# Altium schematic sheet RTC.SchDoc: Titel
size A3; ApprovedBy: name; CompanyName: DCI Electronics bv; DrawnBy: KRS; Address1: Nijverheidsstraat 14; Address2: 4458 AV Eindewege; Address3: Phone: +31 (0)113 344880; DocumentNumber: 10; Revision: 2; SheetNumber: 10; SheetTotal: 14; PageSetup: Record=PageOptions|CenterHorizontal=True|CenterVertical=True|PrintScale=1.00|XCorrection=1.00|YCorrection=1.00|PrintKind=1|BorderSize=5000000|LeftOffset=0|BottomOffset=0|Orientation=2|PaperLength=1000|PaperWidth=1000|Scale=100|PaperSource=7|PrintQuality=-4|MediaType=1|DitherType=10|PaperKind=ISO_A4_(210.00_x_297.00_MM)|PrintScaleMode=1; SubTitle: SubTitel; ApprovedDate: 01-01-12
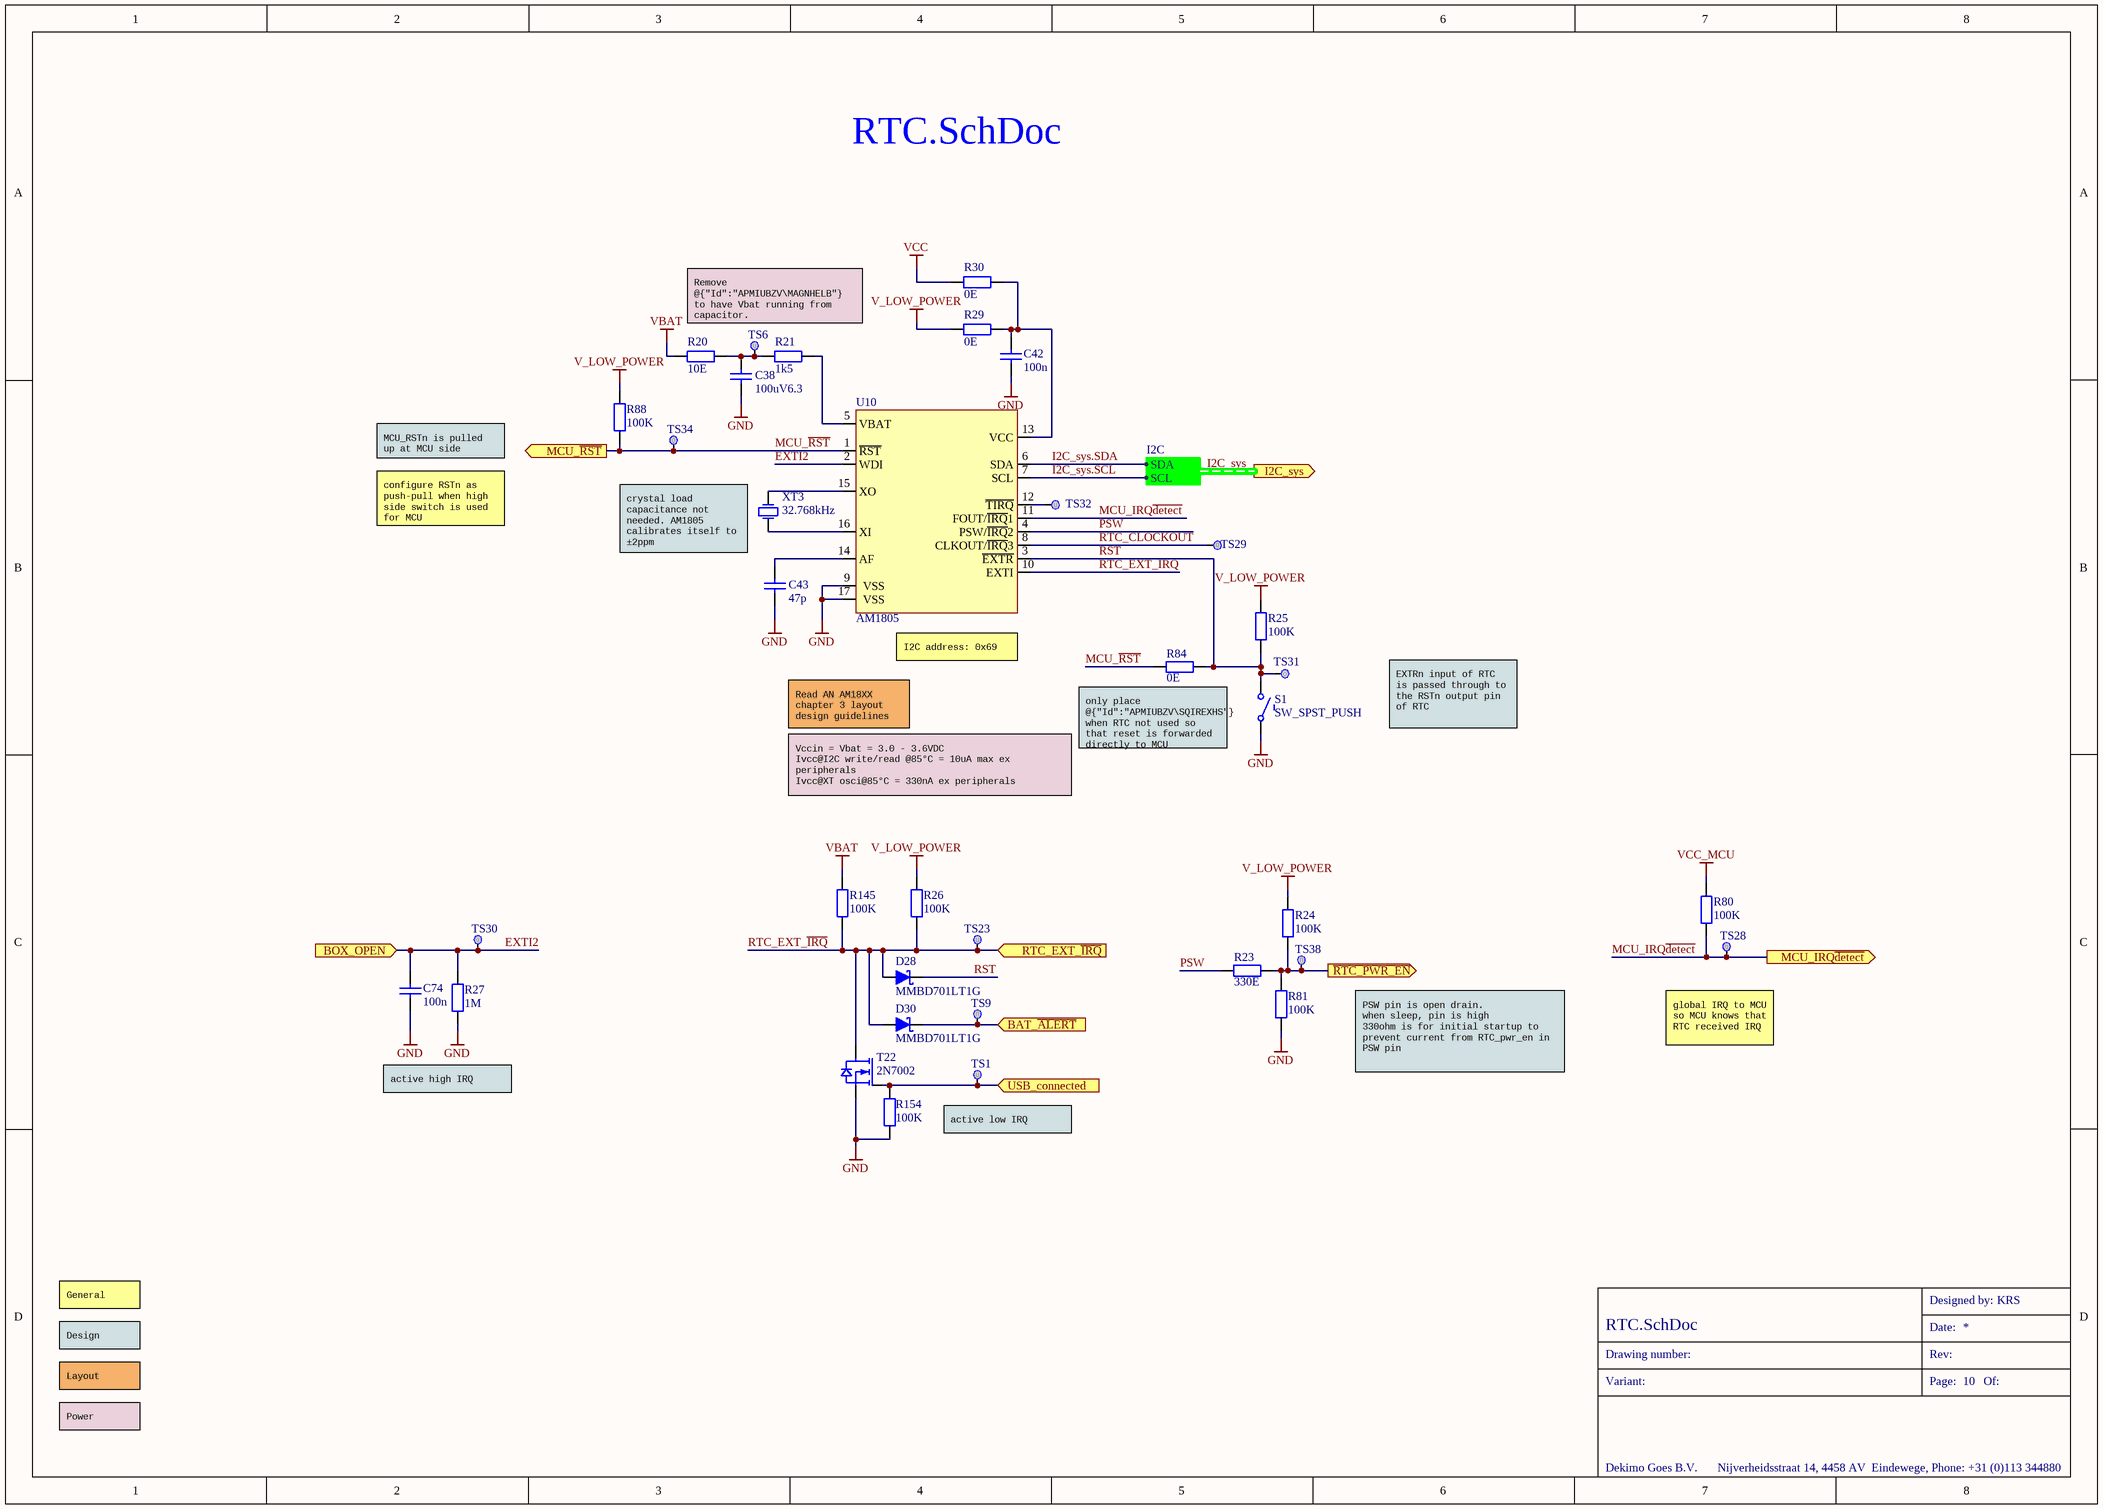
[diagram p0: RTC.SchDoc]

## Parts
C38  100uV6.3  [CAPC3216X13N]
C42  100n  [CAPC1608X09N]
C43  47p  [CAPC1608X09N]
C74  100n  [CAPC1608X09N]
D28  MMBD701LT1G  [SOT95P245X110-3N]
D30  MMBD701LT1G  [SOT95P245X110-3N]
R20  10E  [RESC1608X13N]
R21  1k5  [RESC1608X13N]
R23  330E  [RESC1608X13N]
R24  100K  [RESC1608X13N]
R25  100K  [RESC1608X13N]
R26  100K  [RESC1608X13N]
R27  1M  [RESC1608X13N]
R29  0E  [RESC1005X04N]
R30  0E  [RESC1005X04N]
R80  100K  [RESC1608X13N]
R81  100K  [RESC1608X13N]
R84  0E  [RESC1608X13N]
R88  100K  [RESC1608X13N]
R145  100K  [RESC1608X13N]
R154  100K  [RESC1608X13N]
S1  SW_SPST_PUSH  [B3S-1000P]
T22  2N7002  [SOT95P245X110_GSD-3N]
TS1  TESTPAD  [TESTPAD 2MM]  (value not drawn)  (no BOM)
TS6  TESTPAD  [TESTPAD 2MM]  (value not drawn)  (no BOM)
TS9  TESTPAD  [TESTPAD 2MM]  (value not drawn)  (no BOM)
TS23  TESTPAD  [TESTPAD 2MM]  (value not drawn)  (no BOM)
TS28  TESTPAD  [TESTPAD 2MM]  (value not drawn)  (no BOM)
TS29  TESTPAD  [TESTPAD 2MM]  (value not drawn)  (no BOM)
TS30  TESTPAD  [TESTPAD 2MM]  (value not drawn)  (no BOM)
TS31  TESTPAD  [TESTPAD 2MM]  (value not drawn)  (no BOM)
TS32  TESTPAD  [TESTPAD 2MM]  (value not drawn)  (no BOM)
TS34  TESTPAD  [TESTPAD 2MM]  (value not drawn)  (no BOM)
TS38  TESTPAD  [TESTPAD 2MM]  (value not drawn)  (no BOM)
U10  AM1805  [QFN-500G000-016]
XT3  32.768kHz  [CHIP2PINSM127P600-8N]

## Ports
BAT_~{ALERT} (in), BOX_OPEN (in), I2C_sys (out, harness I2C), MCU_IRQ~{detect} (out), MCU_~{RST} (out), RTC_EXT_~{IRQ} (in), USB_connected (in), ~{RTC_PWR_EN} (out)

## Harnesses
I2C: SDA, SCL

## Nets
GND: C38.1 C42.1 C43.1 C74.1 R27.1 R81.1 R154.1 S1.COM1(COMMON) T22.S U10.9(VSS) U10.17(VSS)
V_LOW_POWER: R24.2 R25.2 R26.2 R29.1 R88.2
VBAT: R20.1 R145.2
VCC: R30.1
VCC_MCU: R80.2
\: D28.C R25.1 R84.2 S1.NO1(NO) TS31.1(TP) U10.3(~{EXTR})  [also labelled RST]
~{RTC_PWR_EN}: R23.2 R24.1 R81.2 TS38.1(TP) ; port ~{RTC_PWR_EN}
BAT_~{ALERT}: D30.C TS9.1(TP) ; port BAT_~{ALERT}
EXTI2: C74.2 R27.2 TS30.1(TP) U10.2(WDI) ; port BOX_OPEN
I2C_sys.SCL: U10.7(SCL) ; port I2C_sys.SCL
I2C_sys.SDA: U10.6(SDA) ; port I2C_sys.SDA
MCU_IRQ~{detect}: R80.1 TS28.1(TP) U10.11(FOUT/~{IRQ}1) ; port MCU_IRQ~{detect}
MCU_~{RST}: R84.1 R88.1 TS34.1(TP) U10.1(~{RST}) ; port MCU_~{RST}
PSW: R23.1 U10.4(PSW/~{IRQ}2)
RTC_CLOCKOUT: TS29.1(TP) U10.8(CLKOUT/~{IRQ}3)
RTC_EXT_~{IRQ}: D28.A D30.A R26.1 R145.1 T22.D TS23.1(TP) U10.10(EXTI) ; port RTC_EXT_~{IRQ}
USB_connected: R154.2 T22.G TS1.1(TP) ; port USB_connected
NetC38_2: C38.2 R20.2 R21.1 TS6.1(TP)
NetC42_2: C42.2 R29.2 R30.2 U10.13(VCC)
NetC43_2: C43.2 U10.14(AF)
NetR21_2: R21.2 U10.5(VBAT)
NetTS32_1: TS32.1(TP) U10.12(~{TIRQ})
NetU10_15: U10.15(XO) XT3.2(OSC2)
NetU10_16: U10.16(XI) XT3.1(OSC1)

## Buses and harness runs
harness I2C_sys = port I2C_sys

## Notes on the sheet
- Remove @{"Id":"APMIUBZV\MAGNHELB"} to have Vbat running from capacitor.
  100uF gives about 1.7h run time in autocal mode
- MCU_RSTn is pulled up at MCU side
- configure RSTn as push-pull when high side switch is used for MCU
- (near XT3) crystal load capacitance not needed. AM1805 calibrates itself to ±2ppm
- Read AN AM18XX chapter 3 layout design guidelines
- (near U10) I2C address: 0x69
- EXTRn input of RTC is passed through to the RSTn output pin of RTC
- only place @{"Id":"APMIUBZV\SQIREXHS"} when RTC not used so that reset is forwarded directly to MCU
- Vccin = Vbat = 3.0 - 3.6VDC
  Ivcc@I2C write/read @85°C = 10uA max ex peripherals
  Ivcc@XT osci@85°C = 330nA ex peripherals
- (near TS28) global IRQ to MCU so MCU knows that RTC received IRQ
- active high IRQ
- (near TS1) active low IRQ
- PSW pin is open drain.
  when sleep, pin is high
  330ohm is for initial startup to prevent current from RTC_pwr_en in PSW pin
- General
- Design
- Layout
- Power
- Designed by:
- Drawing number:
- Variant:
- Date:
- Page:
- Rev:
- Of:
- Dekimo Goes B.V.
- Nijverheidsstraat 14, 4458 AV  Eindewege, Phone: +31 (0)113 344880

## Library data of the parts
C38 = CKE 100UV6.3/10: 100uF 20% 6.3VX5R; EngPartGrpMainCode: CAP; ManufactpartCode: GRM31CR60J107ME39L-MUR; Type: Capacitor ceramic SMD; Preferred: False; SMD_Flag: True; PartCode: CKE 100UV6.3/10
C42 C74 = CKE 100N/60: 100nF 50V 10% X7R; EngPartGrpMainCode: CAP; ManufactpartCode: CC0603KRX7R9BB104-YAG; Type: Capacitor ceramic SMD; Preferred: False; SMD_Flag: True; PartCode: CKE 100N/60
C43 = CKE 47P/60: 47p 50V 5% NP0; EngPartGrpMainCode: CAP; ManufactpartCode: CC0603JRNPO9BN470-YAG; Type: Capacitor ceramic SMD; Preferred: False; SMD_Flag: True; PartCode: CKE 47P/60
D28 D30 = DIO MMBD701LT1G: 70V Low leakage 200nA; EngPartGrpMainCode: DIO; ManufactpartCode: MMBD701LT1G-ONS; Type: Diode schottky SMD; Preferred: False; SMD_Flag: True; PartCode: DIO MMBD701LT1G
R20 = R 10E/60: 10E 0.1W 1%; EngPartGrpMainCode: RES; ManufactpartCode: RC0603FR-0710RL-YAG; Preferred: False; SMD_Flag: True; PartCode: R 10E/60; Type: Resistor metalfilm SMD
R21 = R 1K5/60: 1K5, 100mW, 1%; EngPartGrpMainCode: RES; ManufactpartCode: RC0603FR-071K5L-YAG; Preferred: False; SMD_Flag: True; PartCode: R 1K5/60; Type: Resistor metalfilm SMD
R23 = R 330E/60: 330E, 100mW, 1%; EngPartGrpMainCode: RES; ManufactpartCode: RC0603FR-07330RL-YAG; Preferred: True; PartCode: R 330E/60; Type: Resistor metalfilm SMD; SMD_Flag: True
R24-R26 R80 R81 R88 R145 R154 = R 100K/60: 100k 100mW, 1%; EngPartGrpMainCode: RES; ManufactpartCode: CRG0603F100K-TEC; Preferred: True; PartCode: R 100K/60; Type: Resistor metalfilm SMD; SMD_Flag: True
R27 = R 1M/60: 1M 0.1W 1%; PartCode: R 1M/60; EngPartGrpMainCode: RES; ManufactpartCode: RC0603FR-071ML-YAG; Preferred: False; SMD_Flag: True; Type: Resistor metalfilm SMD
R29 R30 = R 0E/70: 0E, 62.5mW, 1%; PartCode: R 0E/70; EngPartGrpMainCode: RES; ManufactpartCode: RC0402JR-070RL-YAG; Preferred: False; SMD_Flag: True; Type: Resistor metalfilm SMD
R84 = R 0E/60: 0E 100mW, 1%; PartCode: R 0E/60; EngPartGrpMainCode: RES; ManufactpartCode: RC0603FR-070RL-YAG; Preferred: True; Type: Resistor metalfilm SMD; SMD_Flag: True
S1 = SW PBSPNO/25: PCB SPNO 6x6.6mm, h=4,3mm refl; EngPartGrpMainCode: SWI; ManufactpartCode: B3S-1000P-OMR; Preferred: False; SMD_Flag: True; PartCode: SW PBSPNO/25; Type: Switch push button SMD
T22 = TRA 2N7002: 60V 115mA; EngPartGrpMainCode: TRAN; ManufactpartCode: 2N7002-PHI; Type: FET N-channel SMD; Preferred: False; SMD_Flag: True; PartCode: TRA 2N7002
TS1 TS6 TS9 TS23 TS28-TS32 TS34 TS38 = TESTPAD-2.0: 0.5mm Testpad SMD; PartCode: TESTPAD-2.0
U10 = IC AM1805: Low power I2C RTC; EngPartGrpMainCode: IC; ManufactpartCode: AM1805AQ-AMB; Preferred: False; SMD_Flag: True; PartCode: IC AM1805; Type: IC RTC SMD
XT3 = XT 32.768KHZ/S2: 32.768kHz 20ppm 12.5pF; ManufactpartCode: FC-135 32.7680KA-A3-EPS; Preferred: False; SMD_Flag: True; PartCode: XT 32.768KHZ/S2; EngPartGrpMainCode: XTAL; Type: Quarz crystal SMD